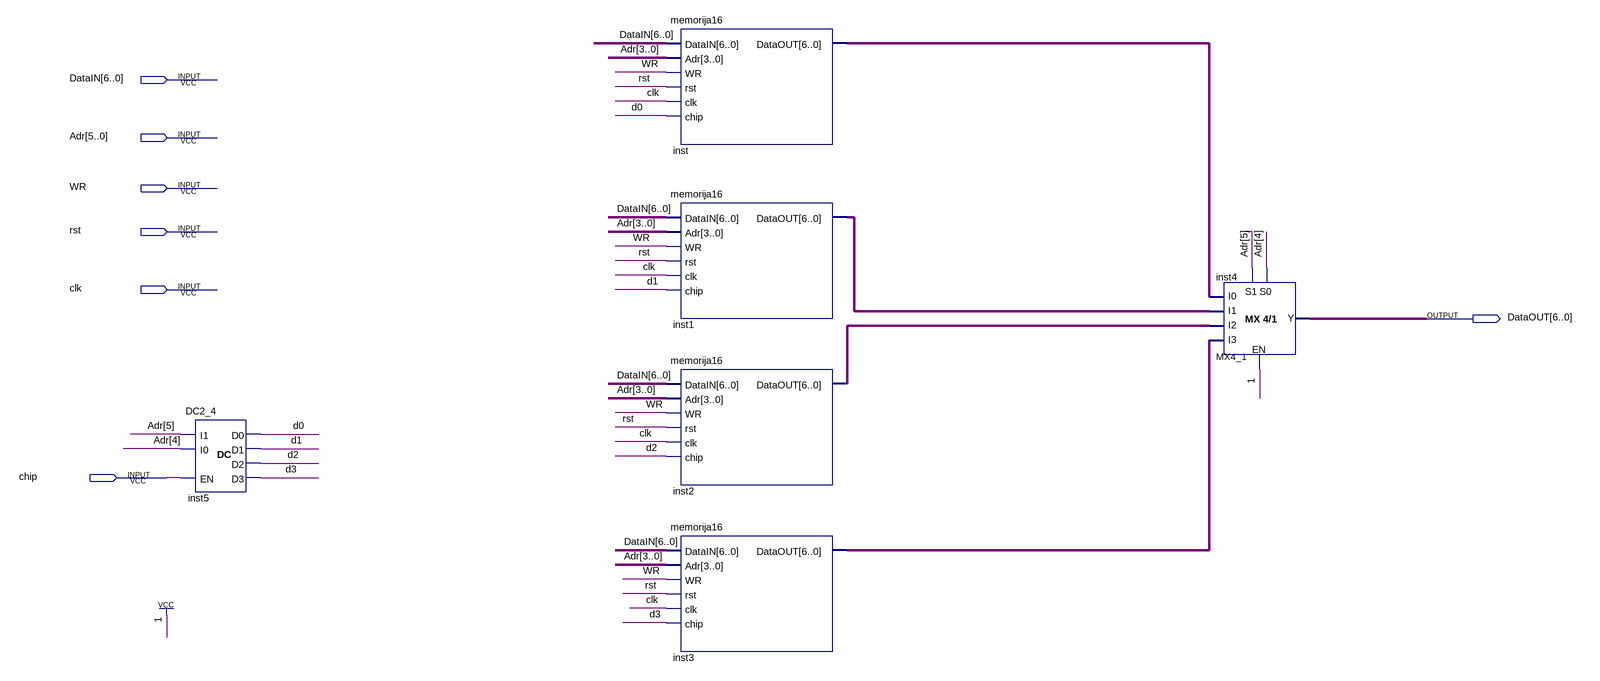
[diagram p0: schematic sheet]
// Quartus schematic memorija64.bdf as structural Verilog: 6 symbols, 7 pins
module memorija64 (
  input  [6:0] DataIN,
  input  [5:0] Adr,
  input  WR,
  input  rst,
  input  clk,
  input  chip,
  output [6:0] DataOUT
);

  wire d0, d1, d2, d3;
  wire [6:0] inst1_dataout, inst2_dataout, inst3_dataout, inst_dataout;

  DC2_4 inst5 (.I0(Adr[4]), .I1(Adr[5]), .EN(chip), .D0(d0), .D1(d1), .D2(d2), .D3(d3));
  memorija16 inst (.DataIN(DataIN), .Adr(Adr[3:0]), .WR(WR), .rst(rst), .clk(clk), .chip(d0), .DataOUT(inst_dataout));
  memorija16 inst1 (.DataIN(DataIN), .Adr(Adr[3:0]), .WR(WR), .rst(rst), .clk(clk), .chip(d1), .DataOUT(inst1_dataout));
  memorija16 inst2 (.DataIN(DataIN), .Adr(Adr[3:0]), .WR(WR), .rst(rst), .clk(clk), .chip(d2), .DataOUT(inst2_dataout));
  memorija16 inst3 (.DataIN(DataIN), .Adr(Adr[3:0]), .WR(WR), .rst(rst), .clk(clk), .chip(d3), .DataOUT(inst3_dataout));
  MX4_1 inst4 (
    .S1(Adr[5]), .S0(Adr[4]), .EN(1'b1), .I3(inst3_dataout), .I2(inst2_dataout), .I1(inst1_dataout),
    .I0(inst_dataout), .Y(DataOUT));
endmodule
